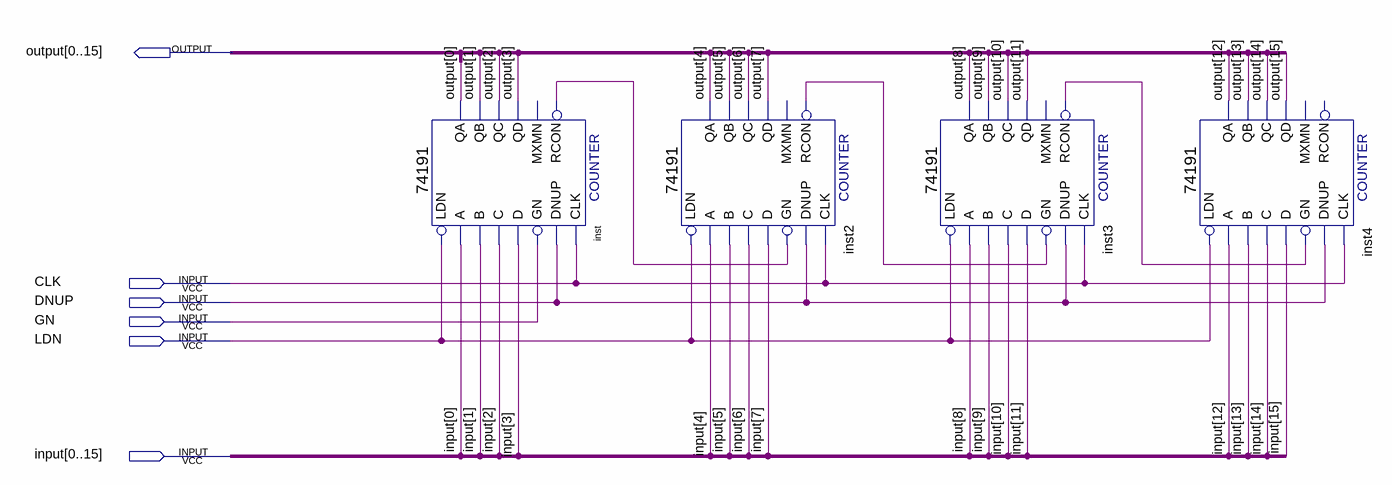
[diagram p0: schematic sheet]
// Quartus schematic inc_dec_latch.bdf as structural Verilog: 4 symbols, 6 pins
module inc_dec_latch (
  input  CLK,
  input  DNUP,
  input  GN,
  input  LDN,
  input  [0:15] \input ,
  output [0:15] \output 
);

  wire inst2_rcon, inst3_rcon, inst_rcon;

  \74191  inst (
    .LDN(LDN), .D(\input [3]), .C(\input [2]), .B(\input [1]), .A(\input [0]), .CLK(CLK), .DNUP(DNUP),
    .GN(GN), .RCON(inst_rcon), .QA(\output [0]), .QB(\output [1]), .QD(\output [3]), .QC(\output [2]));  // open: MXMN
  \74191  inst2 (
    .LDN(LDN), .D(\input [7]), .C(\input [6]), .B(\input [5]), .A(\input [4]), .CLK(CLK), .DNUP(DNUP),
    .GN(inst_rcon), .RCON(inst2_rcon), .QA(\output [4]), .QB(\output [5]), .QD(\output [7]), .QC(\output [6]));  // open: MXMN
  \74191  inst3 (
    .LDN(LDN), .D(\input [11]), .C(\input [10]), .B(\input [9]), .A(\input [8]), .CLK(CLK), .DNUP(DNUP),
    .GN(inst2_rcon), .RCON(inst3_rcon), .QA(\output [8]), .QB(\output [9]), .QD(\output [11]),
    .QC(\output [10]));  // open: MXMN
  \74191  inst4 (
    .LDN(LDN), .D(\input [15]), .C(\input [14]), .B(\input [13]), .A(\input [12]), .CLK(CLK), .DNUP(DNUP),
    .GN(inst3_rcon), .QA(\output [12]), .QB(\output [13]), .QD(\output [15]), .QC(\output [14]));  // open: RCON, MXMN
endmodule
